# EAGLE design gy_521 (EAGLE 6.6.0)
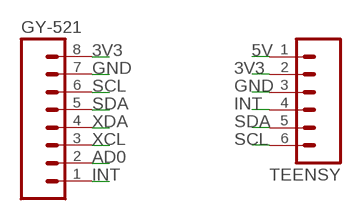
[diagram p0: schematic, sheet 1]

## Parts
GY-521  M081X08  [1X08]
TEENSY  M06NO_SILK  [1X06_NO_SILK]

## Nets
3V3: GY-521.8 TEENSY.2
5V: TEENSY.1
AD0: GY-521.2
GND: GY-521.7 TEENSY.3
INT: GY-521.1 TEENSY.4
SCL: GY-521.6 TEENSY.6
SDA: GY-521.5 TEENSY.5
XCL: GY-521.3
XDA: GY-521.4

## Library data of the parts
GY-521 = SparkFun-Connectors:M08: Header 8 Standard 8-pin 0.1" header. Use with straight break away headers (SKU : PRT-00116), right angle break away headers (PRT-00553), swiss pins (PRT-00743), machine pins (PRT-00117), and female headers (PRT-00115).
TEENSY = SparkFun-Connectors:M06: Header 6 Standard 6-pin 0.1" header. Use with straight break away headers (SKU : PRT-00116), right angle break away headers (PRT-00553), swiss pins (PRT-00743), machine pins (PRT-00117), and female headers (PRT-00115). Molex polarized connector foot print use with SKU : PRT-08094 with associated crimp pins and housings. NOTES ON THE VARIANTS LOCK and LOCK_LONGPADS... This footprint was designed to help hold the alignment of a through-hole component (i.e. 6-pin header) while soldering it into place. You may notice that each hole has been shifted either up or down by 0.005 of an inch from it's more standard position (which is a perfectly straight line). This slight alteration caused the pins (the squares in the middle) to touch the edges of the holes. Because they are alternating, it causes a "brace" to hold the component in place. 0.005 has proven to be the perfect amount of "off-center" position when using our standard breakaway headers. Although looks a little odd when you look at the bare footprint, once you have a header in there, the alteration is very hard to notice. Also,if you push a header all the way into place, it is covered up entirely on the bottom side. This idea of altering the position of holes to aid alignment will be further integrated into the Sparkfun Library for other footprints. It can help hold any component with 3 or more connection pins.

## Board
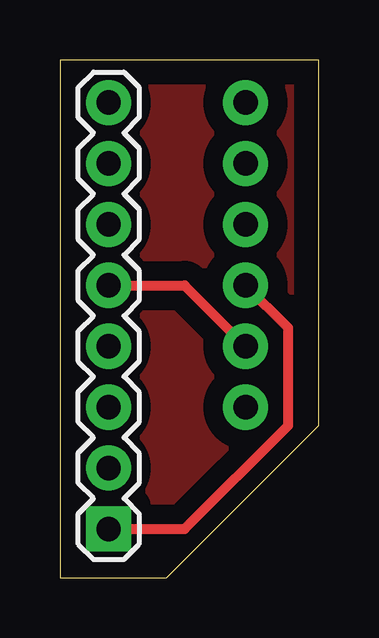
[diagram p1: board, top side]
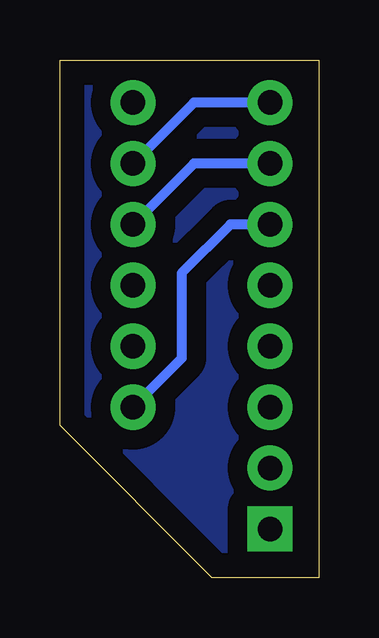
[diagram p2: board, bottom side, seen from below]

Size 10.79 x 21.59 mm. Coordinates in mm from the lower left corner, seen from the top.
Outline: 0,0 4.45,0 10.79,6.35 10.79,21.59 0,21.59 0,0
Copper layers (1*16): Top 0.035mm / dielectric 1.5mm / Bottom 0.035mm
Design rules "default": minimum track width 10mil, minimum drill 24mil, track to track 8mil, track to pad 8mil, pad to pad 8mil, via to via 8mil, smd to smd 8mil, copper to edge 40mil, drill to drill 8mil, minimum pad ring 10mil, minimum via ring 8mil, stop-mask expansion 4mil, vias tented up to drill 0mil, thermal gap 10mil

### Footprints (pad centres in the part's own frame; a part is rotated, then mirrored left to right if it is on the bottom)
1X08 = drill 1.016 pad 1.88 square: 1 0,0 | drill 1.016 pad 1.88: 2 2.54,0; 3 5.08,0; 4 7.62,0; 5 10.16,0; 6 12.7,0; 7 15.24,0; 8 17.78,0
1X06_NO_SILK = drill 1.016 pad 1.88: 1 0,0; 2 2.54,0; 3 5.08,0; 4 7.62,0; 5 10.16,0; 6 12.7,0

### Placement (x,y rotation side)
GY-521  2.03,2.03 90 top
TEENSY  7.75,19.81 270 top

### Tracks (layer width: path | path; a pad name or v marks a point on that pad's centre or on a via)
3V3
  Bottom 0.406: GY-521.8 5.21,19.81 TEENSY.2
GND
  Bottom 0.406: GY-521.7 5.21,17.27 TEENSY.3
INT
  Top 0.406: GY-521.1 5.21,2.03 9.53,6.35 9.53,10.41 TEENSY.4
N$1
  pour Bottom (isolate 0.813): 0,21.59 0,0 4.45,0 10.79,6.35 10.79,21.59
N$2
  pour Top (isolate 0.813): 0,21.59 10.79,21.59 10.79,6.35 4.45,0 0,0
SCL
  Bottom 0.406: GY-521.6 3.68,14.73 5.71,12.7 5.71,9.14 TEENSY.6
SDA
  Top 0.406: GY-521.5 5.21,12.19 TEENSY.5